# EAGLE schematic PSD+Mount (EAGLE 9.7.0)
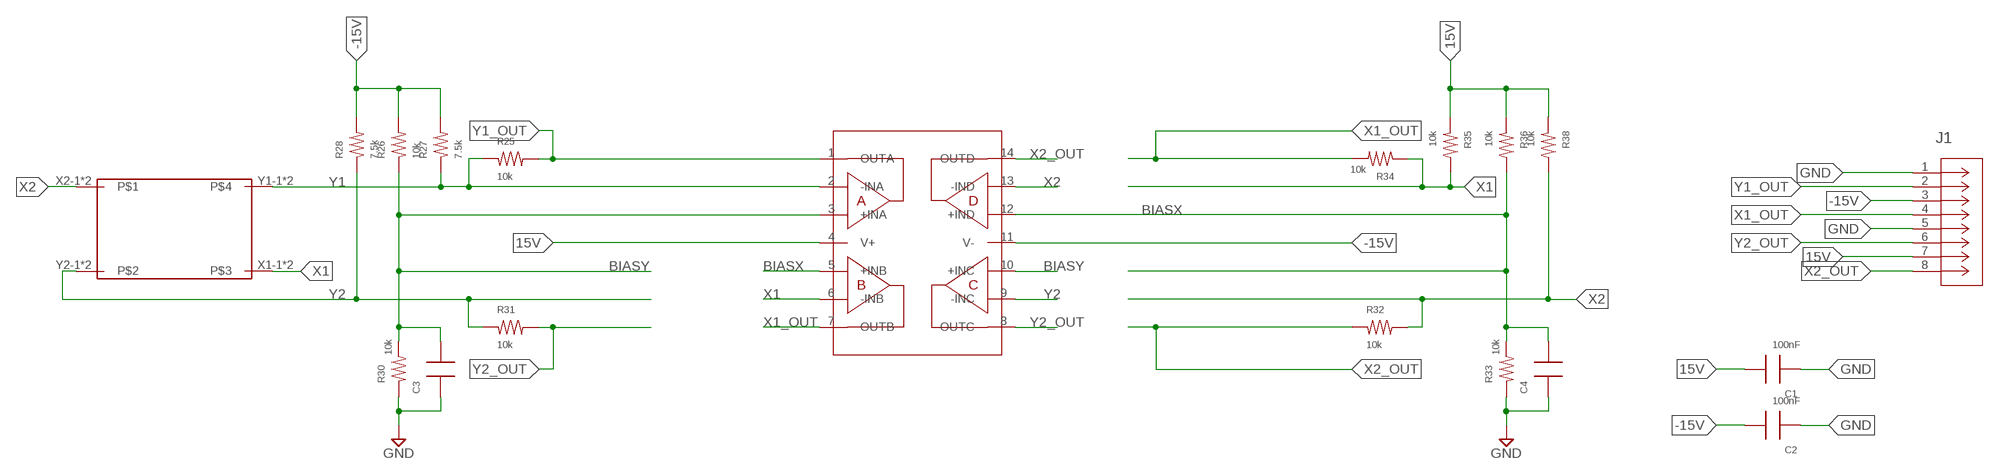
[diagram p0: schematic, sheet 1]

## Parts
AMP1  OPA4140  [SOP65P640X120-14N]
C1  100nF  CAP0603  [0603]
C2  100nF  CAP0603  [0603]
C3  CAP0603  [0603]
C4  CAP0603  [0603]
J1  75869-332LF  [CONN_332LF_AMP]
R25  10k  RES0603  [0603]
R26  10k  RES0603  [0603]
R27  7.5k  RES0603  [0603]
R28  7.5k  RES0603  [0603]
R30  10k  RES0603  [0603]
R31  10k  RES0603  [0603]
R32  10k  RES0603  [0603]
R33  10k  RES0603  [0603]
R34  10k  RES0603  [0603]
R35  10k  RES0603  [0603]
R36  10k  RES0603  [0603]
R38  10k  RES0603  [0603]
U$1  2L10UV_SU7  [2L10UV_SU7]

## Nets
15V: AMP1.4(V+) C1.2 J1.7 R35.1 R36.1 R38.1
-15V: AMP1.11(V-) C2.2 J1.3 R26.2 R27.2 R28.2
BIASX: AMP1.5(+INB) AMP1.12(+IND) C4.2 R33.2 R36.2
BIASY: AMP1.3(+INA) AMP1.10(+INC) C3.2 R26.1 R30.2
GND: C1.1 C2.1 C3.1 C4.1 J1.1 J1.5 R30.1 R33.1
X1: AMP1.6(-INB) R34.1 R35.2 U$1.X1-1 U$1.X1-2
X1_OUT: AMP1.7(OUTB) J1.4 R34.2
X2: AMP1.13(-IND) R32.2 R38.2 U$1.X2-1 U$1.X2-2
X2_OUT: AMP1.14(OUTD) J1.8 R32.1
Y1: AMP1.2(-INA) R25.1 R27.1 U$1.Y1-1 U$1.Y1-2
Y1_OUT: AMP1.1(OUTA) J1.2 R25.2
Y2: AMP1.9(-INC) R28.1 R31.1 U$1.Y2-1 U$1.Y2-2
Y2_OUT: AMP1.8(OUTC) J1.6 R31.2

## Library data of the parts
AMP1 = OPA4140:OPA4140; DIGIKEY: 296-46322-1-ND
C1-C4 = rlc-jqi:CAP: SMT Capacitor; DIGIKEY: 478-7018-1-ND
J1 = 75869-332LF:75869-332LF; BUILT_BY: EMA_Matt; COPYRIGHT: Copyright (C) 2018 Accelerated Designs. All rights reserved; DIGIKEY: 609-5123-ND; MANUFACTURER_PART_NUMBER: 75869-332LF; SOURCELIBRARY: Amphenol_2019-10-30; VENDOR: Amphenol
R25-R28 R30-R36 R38 = rlc-jqi:RES: SMT Resistor; DIGIKEY: YAG1236CT-ND
U$1 = 2L10UV-MP1:2L10UV_SU7

## Net classes
0 p: width 0.254 mm
1 10 mil: width 0.254 mm